# Altium project final_clock.PrjPCB
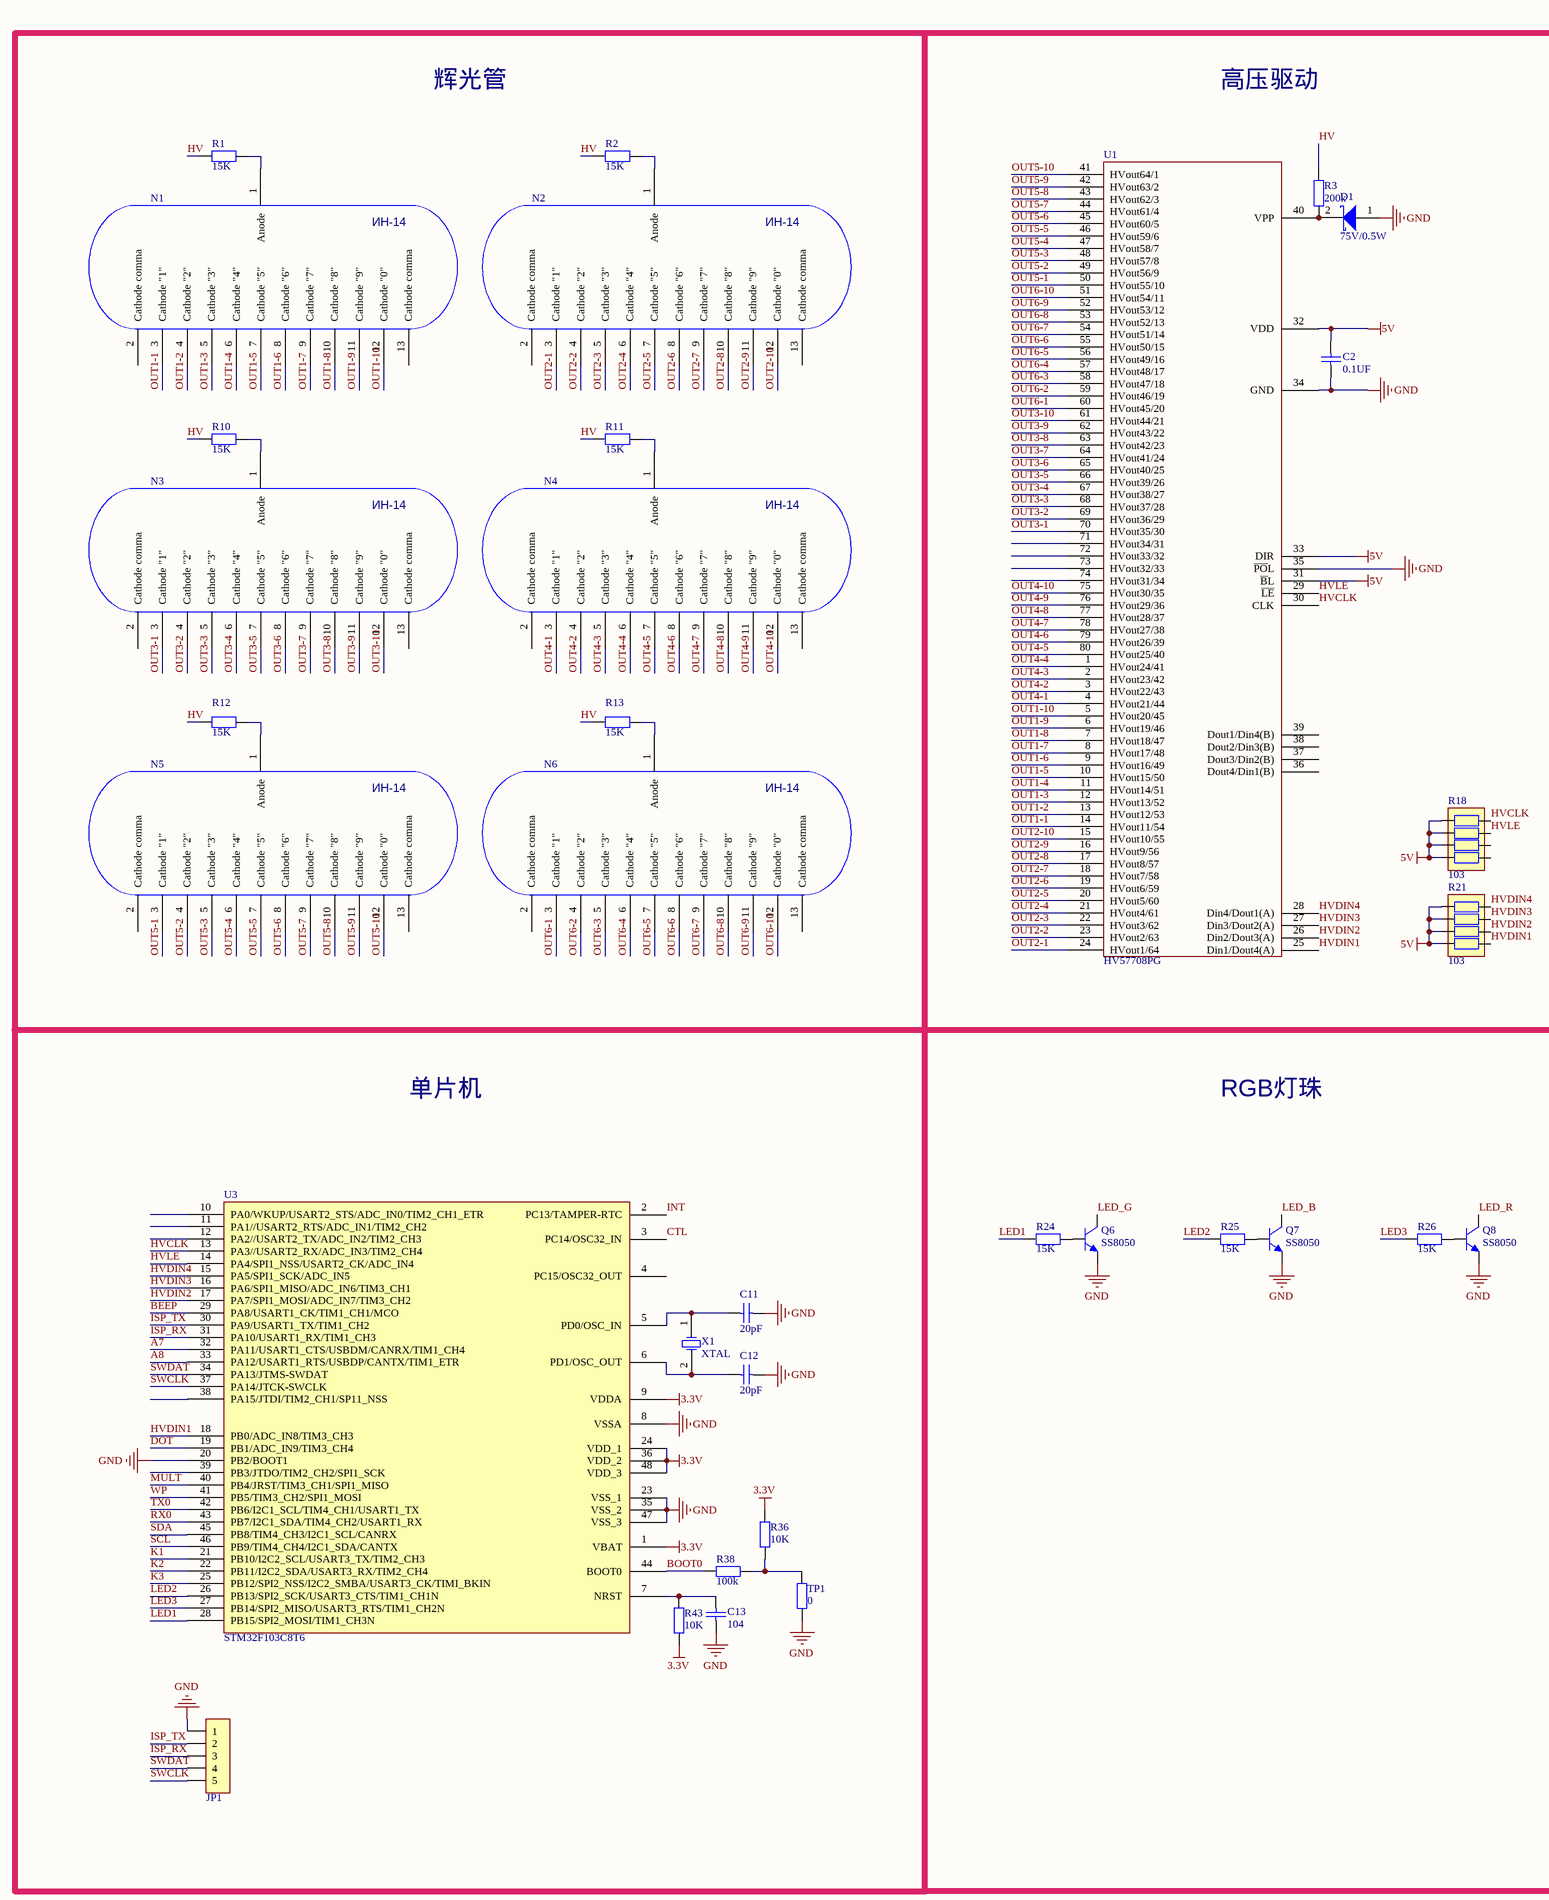
[diagram p0: final_clock.SchDoc, left]
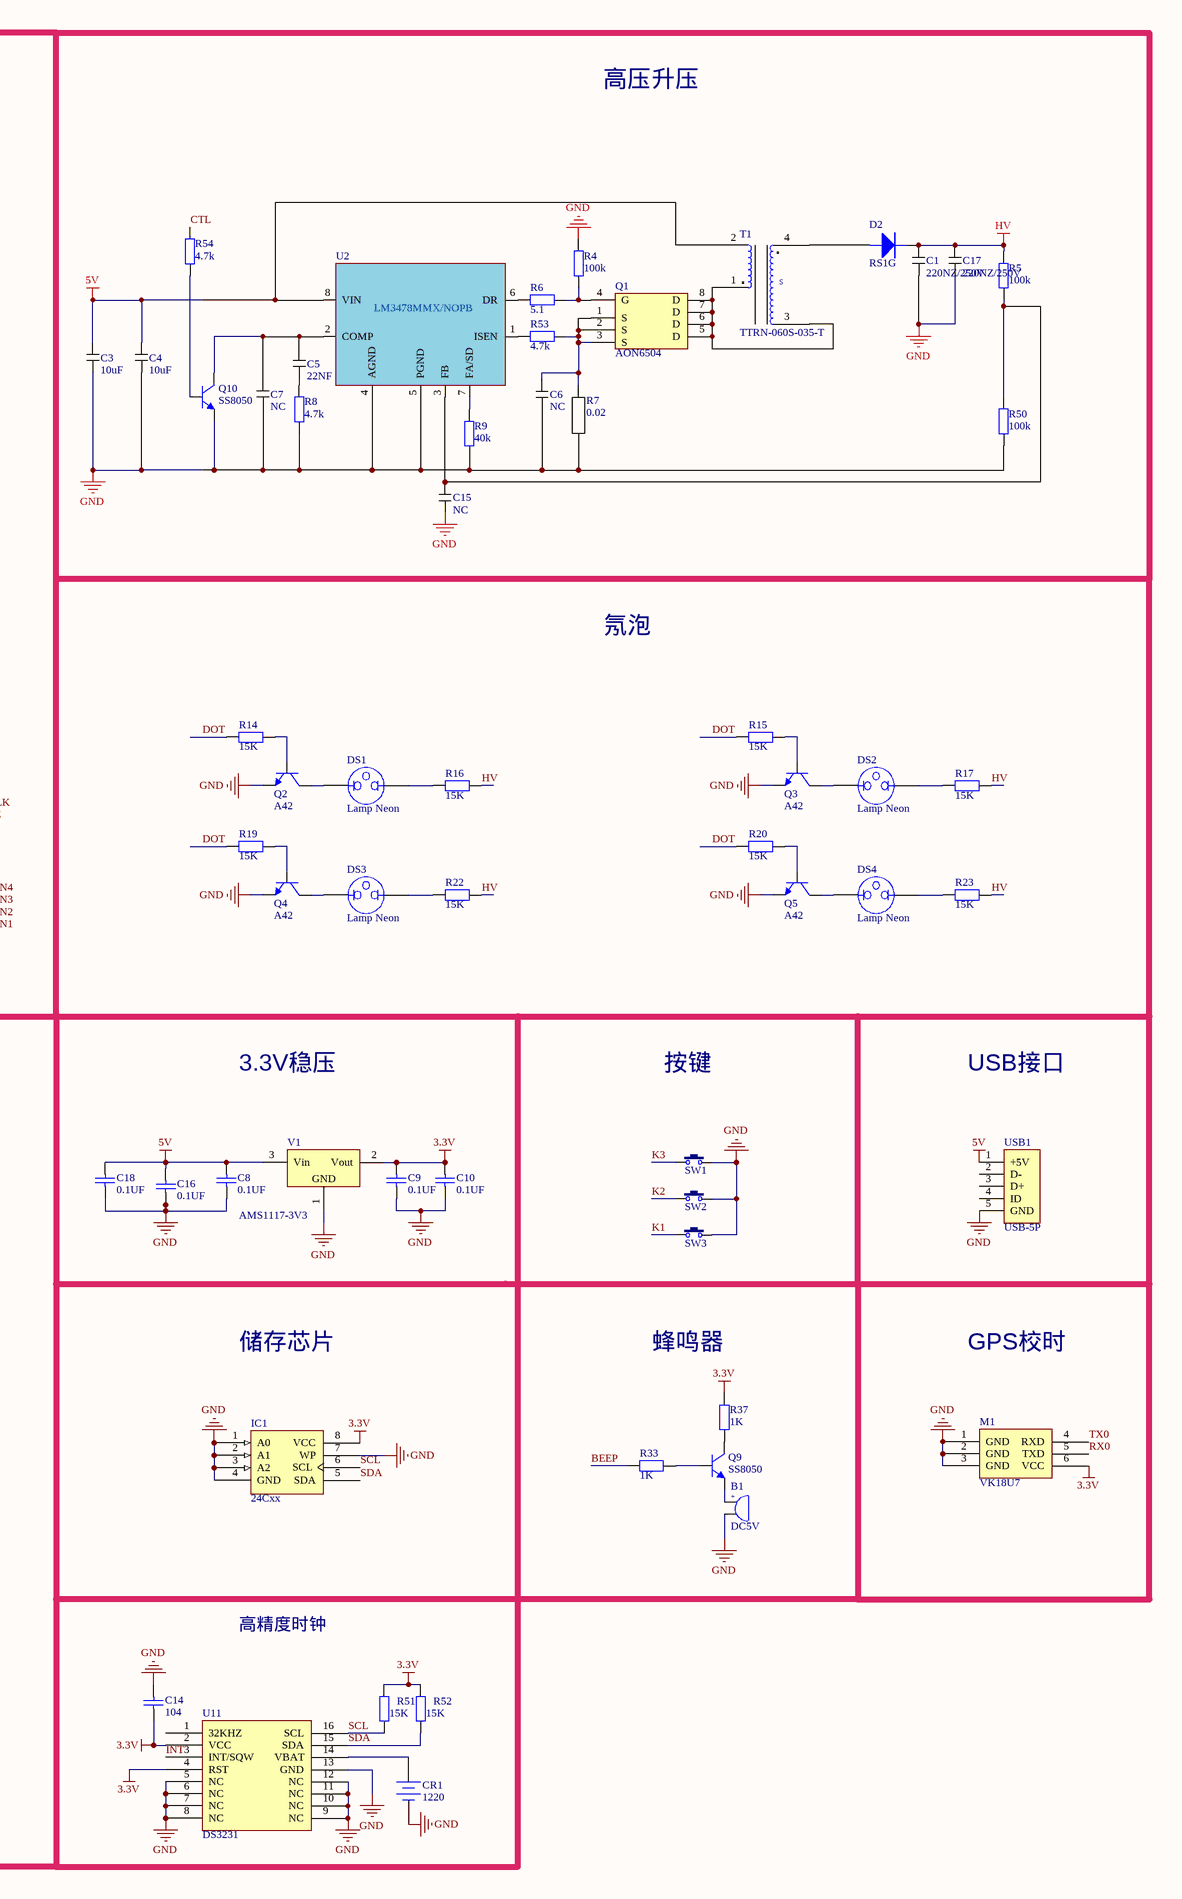
[diagram p1: final_clock.SchDoc, right]
1 sheet, 93 parts. Net scope: global (net labels, ports and power ports of the same name join across sheets).
Board file: final_clock.PcbDoc

## Sheet final_clock.SchDoc
size A2

### Parts
B1  DC5V  [贴片蜂鸣器]
C1  220NZ/250V  [C 1812]
C2  value 0.1UF  [C 0805]  (hidden comment: Cap)
C3  10uF  [C 1812]
C4  10uF  [C 1812]
C5  22NF  [C 0805]
C6  NC  [C 0805]
C7  NC  [C 0805]
C8  value 0.1UF  [C 0805]  (hidden comment: Cap)
C9  value 0.1UF  [C 0805]  (hidden comment: Cap)
C10  value 0.1UF  [C 0805]  (hidden comment: Cap)
C11  value 20pF  [C 0805]  (hidden comment: Cap)
C12  value 20pF  [C 0805]  (hidden comment: Cap)
C13  value 104  [C 0805]  (hidden comment: Cap)
C14  value 104  [C 0805]  (hidden comment: Cap)
C15  NC  [C 0805]
C16  value 0.1UF  [C 0805]  (hidden comment: Cap)
C17  220NZ/250V  [C 1812]
C18  value 0.1UF  [C 0805]  (hidden comment: Cap)
CR1  1220  [CR1220_A]
D1  75V/0.5W  [R 1206]
D2  RS1G  [SMA]
DS1  Lamp Neon  [LED_PIN2]
DS2  Lamp Neon  [LED_PIN2]
DS3  Lamp Neon  [LED_PIN2]
DS4  Lamp Neon  [LED_PIN2]
IC1  24Cxx  [SOP8_L]
JP1  HDR-1X5  [HDR-1X5]  (value not drawn)
M1  VK18U7  [VK18U7]
N1  ИН-14  [IN14]  (value not drawn)
N2  ИН-14  [IN14]  (value not drawn)
N3  ИН-14  [IN14]  (value not drawn)
N4  ИН-14  [IN14]  (value not drawn)
N5  ИН-14  [IN14]  (value not drawn)
N6  ИН-14  [IN14]  (value not drawn)
Q1  AON6504  [DFN-MOS]
Q2  A42  [SOT23-3L]
Q3  A42  [SOT23-3L]
Q4  A42  [SOT23-3L]
Q5  A42  [SOT23-3L]
Q6  SS8050  [SOT23-3L]
Q7  SS8050  [SOT23-3L]
Q8  SS8050  [SOT23-3L]
Q9  SS8050  [SOT23-3L]
Q10  SS8050  [SOT23-3L]
R1  value 15K  [R 0805]  (hidden comment: Res2)
R2  value 15K  [R 0805]  (hidden comment: Res2)
R3  value 200k  [R 0805]  (hidden comment: Res2)
R4  value 100k  [R 0805]  (hidden comment: Res2)
R5  value 100k  [R 0805]  (hidden comment: Res2)
R6  value 5.1  [R 0805]  (hidden comment: Res2)
R7  0.02  [R 1206]
R8  value 4.7k  [R 0805]  (hidden comment: Res2)
R9  value 40k  [R 0805]  (hidden comment: Res2)
R10  value 15K  [R 0805]  (hidden comment: Res2)
R11  value 15K  [R 0805]  (hidden comment: Res2)
R12  value 15K  [R 0805]  (hidden comment: Res2)
R13  value 15K  [R 0805]  (hidden comment: Res2)
R14  value 15K  [R 0805]  (hidden comment: Res2)
R15  value 15K  [R 0805]  (hidden comment: Res2)
R16  value 15K  [R 0805]  (hidden comment: Res2)
R17  value 15K  [R 0805]  (hidden comment: Res2)
R18  103  [RCA-8P4R-0603]
R19  value 15K  [R 0805]  (hidden comment: Res2)
R20  value 15K  [R 0805]  (hidden comment: Res2)
R21  103  [RCA-8P4R-0603]
R22  value 15K  [R 0805]  (hidden comment: Res2)
R23  value 15K  [R 0805]  (hidden comment: Res2)
R24  value 15K  [R 0805]  (hidden comment: Res2)
R25  value 15K  [R 0805]  (hidden comment: Res2)
R26  value 15K  [R 0805]  (hidden comment: Res2)
R33  value 1K  [R 0805]  (hidden comment: Res2)
R36  value 10K  [R 0805]  (hidden comment: Res2)
R37  value 1K  [R 0805]  (hidden comment: Res2)
R38  value 100k  [R 0805]  (hidden comment: Res2)
R43  value 10K  [R 0805]  (hidden comment: Res2)
R50  value 100k  [R 0805]  (hidden comment: Res2)
R51  value 15K  [R 0805]  (hidden comment: Res2)
R52  value 15K  [R 0805]  (hidden comment: Res2)
R53  value 4.7k  [R 0805]  (hidden comment: Res2)
R54  value 4.7k  [R 0805]  (hidden comment: Res2)
SW1  3x6x5  [贴片侧式按键]  (value not drawn)
SW2  3x6x5  [贴片侧式按键]  (value not drawn)
SW3  3x6x5  [贴片侧式按键]  (value not drawn)
T1  TTRN-060S-035-T  [EE5.0]
TP1  value 0  [R 0805]  (hidden comment: Res2)
U1  HV57708PG  [CQFP80]
U2  PackageReference: LM3478MMX/NOPB  [SSOP8_N]  (hidden comment: LM3478MM)
U3  STM32F103C8T6  [LQFP48 7X7_N]
U11  DS3231  [SOP16W_M]
USB1  USB-5P  [USB-MICRO_A]
V1  AMS1117-3V3  [_SOT-223]
X1  XTAL  [5032-xtal]

### Blocks framed on the sheet
辉光管: N1-N6 R1 R2 R10-R13

### Nets
3.3V: C9.2 C10.2 C14.1 IC1.8(VCC) M1.6(VCC) R36.2 R37.2 R43.2 R51.1 R52.1 U3.1(VBAT) U3.9(VDDA) U3.24(VDD_1) U3.36(VDD_2) U3.48(VDD_3) U11.2(VCC) U11.4(RST) V1.2(Vout)
5V: C2.2 C3.2 C4.2 C8.2 C16.2 C18.2 R18.1 R18.2 R18.3 R18.4 R21.1 R21.2 R21.3 R21.4 T1.2 U1.31(~{B}L) U1.32(VDD) U1.33(DIR) U2.8(VIN) USB1.1(+5V) V1.3(Vin)
GND: B1.2 C1.1 C2.1 C3.1 C4.1 C6.2 C7.1 C8.1 C9.1 C10.1 C11.2 C12.1 C13.1 C14.2 C15.2 C16.1 C17.1 C18.1 CR1.2(DC-) D1.1(A) IC1.1(A0) IC1.2(A1) IC1.3(A2) IC1.4(GND) IC1.7(WP) JP1.1 M1.1(GND) M1.2(GND) M1.3(GND) Q2.2(E) Q3.2(E) Q4.2(E) Q5.2(E) Q6.2(E) Q7.2(E) Q8.2(E) Q10.2(E) R4.1 R7.1 R8.2 R9.2 R50.2 SW1.2 SW2.2 SW3.2 TP1.1 U1.34(GND) U1.35(~{PO}L) U2.4(AGND) U2.5(PGND) U3.8(VSSA) U3.20(PB2/BOOT1) U3.23(VSS_1) U3.35(VSS_2) U3.47(VSS_3) U11.5(NC) U11.6(NC) U11.7(NC) U11.8(NC) U11.9(NC) U11.10(NC) U11.11(NC) U11.12(NC) U11.13(GND) USB1.5(GND) V1.1(GND)
HV: C1.2 C17.2 D2.2(K) R1.2 R2.2 R3.1 R5.1 R10.2 R11.2 R12.2 R13.2 R16.1 R17.1 R22.1 R23.1
A7: U3.32(PA11/USART1_CTS/USBDM/CANRX/TIM1_CH4)
A8: U3.33(PA12/USART1_RTS/USBDP/CANTX/TIM1_ETR)
BEEP: R33.1 U3.29(PA8/USART1_CK/TIM1_CH1/MCO)
BOOT0: R38.1 U3.44(BOOT0)
CTL: R54.2 U3.3(PC14/OSC32_IN)
DOT: R14.2 R15.2 R19.2 R20.2 U3.19(PB1/ADC_IN9/TIM3_CH4)
HVCLK: R18.8 U1.30(CLK) U3.13(PA3//USART2_RX/ADC_IN3/TIM2_CH4)
HVDIN1: R21.5 U1.25(Din1/Dout4(A)) U3.18(PB0/ADC_IN8/TIM3_CH3)
HVDIN2: R21.6 U1.26(Din2/Dout3(A)) U3.17(PA7/SPI1_MOSI/ADC_IN7/TIM3_CH2)
HVDIN3: R21.7 U1.27(Din3/Dout2(A)) U3.16(PA6/SPI1_MISO/ADC_IN6/TIM3_CH1)
HVDIN4: R21.8 U1.28(Din4/Dout1(A)) U3.15(PA5/SPI1_SCK/ADC_IN5)
HVLE: R18.7 U1.29(~{LE}) U3.14(PA4/SPI1_NSS/USART2_CK/ADC_IN4)
INT: U3.2(PC13/TAMPER-RTC) U11.3(INT/SQW)
ISP_RX: JP1.3 U3.31(PA10/USART1_RX/TIM1_CH3)
ISP_TX: JP1.2 U3.30(PA9/USART1_TX/TIM1_CH2)
K1: SW3.1 U3.21(PB10/I2C2_SCL/USART3_TX/TIM2_CH3)
K2: SW2.1 U3.22(PB11/I2C2_SDA/USART3_RX/TIM2_CH4)
K3: SW1.1 U3.25(PB12/SPI2_NSS/I2C2_SMBA/USART3_CK/TIMI_BKIN)
LED1: R24.2 U3.28(PB15/SPI2_MOSI/TIM1_CH3N)
LED2: R25.2 U3.26(PB13/SPI2_SCK/USART3_CTS/TIM1_CH1N)
LED3: R26.2 U3.27(PB14/SPI2_MISO/USART3_RTS/TIM1_CH2N)
LED_B: Q7.3(C)
LED_G: Q6.3(C)
LED_R: Q8.3(C)
MULT: U3.40(PB4/JRST/TIM3_CH1/SPI1_MISO)
OUT1-1: N1.3(Cathode_"1") U1.14(HVout11/54)
OUT1-2: N1.4(Cathode_"2") U1.13(HVout12/53)
OUT1-3: N1.5(Cathode_"3") U1.12(HVout13/52)
OUT1-4: N1.6(Cathode_"4") U1.11(HVout14/51)
OUT1-5: N1.7(Cathode_"5") U1.10(HVout15/50)
OUT1-6: N1.8(Cathode_"6") U1.9(HVout16/49)
OUT1-7: N1.9(Cathode_"7") U1.8(HVout17/48)
OUT1-8: N1.10(Cathode_"8") U1.7(HVout18/47)
OUT1-9: N1.11(Cathode_"9") U1.6(HVout19/46)
OUT1-10: N1.12(Cathode_"0") U1.5(HVout20/45)
OUT2-1: N2.3(Cathode_"1") U1.24(HVout1/64)
OUT2-2: N2.4(Cathode_"2") U1.23(HVout2/63)
OUT2-3: N2.5(Cathode_"3") U1.22(HVout3/62)
OUT2-4: N2.6(Cathode_"4") U1.21(HVout4/61)
OUT2-5: N2.7(Cathode_"5") U1.20(HVout5/60)
OUT2-6: N2.8(Cathode_"6") U1.19(HVout6/59)
OUT2-7: N2.9(Cathode_"7") U1.18(HVout7/58)
OUT2-8: N2.10(Cathode_"8") U1.17(HVout8/57)
OUT2-9: N2.11(Cathode_"9") U1.16(HVout9/56)
OUT2-10: N2.12(Cathode_"0") U1.15(HVout10/55)
OUT3-1: N3.3(Cathode_"1") U1.70(HVout35/30)
OUT3-2: N3.4(Cathode_"2") U1.69(HVout36/29)
OUT3-3: N3.5(Cathode_"3") U1.68(HVout37/28)
OUT3-4: N3.6(Cathode_"4") U1.67(HVout38/27)
OUT3-5: N3.7(Cathode_"5") U1.66(HVout39/26)
OUT3-6: N3.8(Cathode_"6") U1.65(HVout40/25)
OUT3-7: N3.9(Cathode_"7") U1.64(HVout41/24)
OUT3-8: N3.10(Cathode_"8") U1.63(HVout42/23)
OUT3-9: N3.11(Cathode_"9") U1.62(HVout43/22)
OUT3-10: N3.12(Cathode_"0") U1.61(HVout44/21)
OUT4-1: N4.3(Cathode_"1") U1.4(HVout21/44)
OUT4-2: N4.4(Cathode_"2") U1.3(HVout22/43)
OUT4-3: N4.5(Cathode_"3") U1.2(HVout23/42)
OUT4-4: N4.6(Cathode_"4") U1.1(HVout24/41)
OUT4-5: N4.7(Cathode_"5") U1.80(HVout25/40)
OUT4-6: N4.8(Cathode_"6") U1.79(HVout26/39)
OUT4-7: N4.9(Cathode_"7") U1.78(HVout27/38)
OUT4-8: N4.10(Cathode_"8") U1.77(HVout28/37)
OUT4-9: N4.11(Cathode_"9") U1.76(HVout29/36)
OUT4-10: N4.12(Cathode_"0") U1.75(HVout30/35)
OUT5-1: N5.3(Cathode_"1") U1.50(HVout55/10)
OUT5-2: N5.4(Cathode_"2") U1.49(HVout56/9)
OUT5-3: N5.5(Cathode_"3") U1.48(HVout57/8)
OUT5-4: N5.6(Cathode_"4") U1.47(HVout58/7)
OUT5-5: N5.7(Cathode_"5") U1.46(HVout59/6)
OUT5-6: N5.8(Cathode_"6") U1.45(HVout60/5)
OUT5-7: N5.9(Cathode_"7") U1.44(HVout61/4)
OUT5-8: N5.10(Cathode_"8") U1.43(HVout62/3)
OUT5-9: N5.11(Cathode_"9") U1.42(HVout63/2)
OUT5-10: N5.12(Cathode_"0") U1.41(HVout64/1)
OUT6-1: N6.3(Cathode_"1") U1.60(HVout45/20)
OUT6-2: N6.4(Cathode_"2") U1.59(HVout46/19)
OUT6-3: N6.5(Cathode_"3") U1.58(HVout47/18)
OUT6-4: N6.6(Cathode_"4") U1.57(HVout48/17)
OUT6-5: N6.7(Cathode_"5") U1.56(HVout49/16)
OUT6-6: N6.8(Cathode_"6") U1.55(HVout50/15)
OUT6-7: N6.9(Cathode_"7") U1.54(HVout51/14)
OUT6-8: N6.10(Cathode_"8") U1.53(HVout52/13)
OUT6-9: N6.11(Cathode_"9") U1.52(HVout53/12)
OUT6-10: N6.12(Cathode_"0") U1.51(HVout54/11)
RX0: M1.5(TXD) U3.43(PB7/I2C1_SDA/TIM4_CH2/USART1_RX)
SCL: IC1.6(SCL) R51.2 U3.46(PB9/TIM4_CH4/I2C1_SDA/CANTX) U11.16(SCL)
SDA: IC1.5(SDA) R52.2 U3.45(PB8/TIM4_CH3/I2C1_SCL/CANRX) U11.15(SDA)
SWCLK: JP1.5 U3.37(PA14/JTCK-SWCLK)
SWDAT: JP1.4 U3.34(PA13/JTMS-SWDAT)
TX0: M1.4(RXD) U3.42(PB6/I2C1_SCL/TIM4_CH1/USART1_TX)
WP: U3.41(PB5/TIM3_CH2/SPI1_MOSI)
NetB1_1: B1.1 Q9.2(E)
NetC5_1: C5.1 R8.1
NetC5_2: C5.2 C7.2 Q10.3(C) U2.2(COMP)
NetC6_1: C6.1 Q1.1(S) Q1.2(S) Q1.3(S) R7.2 R53.2
NetC11_1: C11.1 U3.5(PD0/OSC_IN) X1.1(OSC1)
NetC12_2: C12.2 U3.6(PD1/OSC_OUT) X1.2(OSC2)
NetC13_2: C13.2 R43.1 U3.7(NRST)
NetC15_1: C15.1 R5.2 R50.1 U2.3(FB)
NetCR1_1: CR1.1(DC+) U11.14(VBAT)
NetD1_2: D1.2(K) R3.2 U1.40(VPP)
NetD2_1: D2.1(A) T1.4
NetDS1_1: DS1.1 Q2.3(C)
NetDS1_2: DS1.2 R16.2
NetDS2_1: DS2.1 Q3.3(C)
NetDS2_2: DS2.2 R17.2
NetDS3_1: DS3.1 Q4.3(C)
NetDS3_2: DS3.2 R22.2
NetDS4_1: DS4.1 Q5.3(C)
NetDS4_2: DS4.2 R23.2
NetN1_1: N1.1(Anode) R1.1
NetN2_1: N2.1(Anode) R2.1
NetN3_1: N3.1(Anode) R10.1
NetN4_1: N4.1(Anode) R11.1
NetN5_1: N5.1(Anode) R12.1
NetN6_1: N6.1(Anode) R13.1
NetQ1_4: Q1.4(G) R4.2 R6.2
NetQ1_5: Q1.5(D) Q1.6(D) Q1.7(D) Q1.8(D) T1.1 T1.3
NetQ2_1: Q2.1(B) R14.1
NetQ3_1: Q3.1(B) R15.1
NetQ4_1: Q4.1(B) R19.1
NetQ5_1: Q5.1(B) R20.1
NetQ6_1: Q6.1(B) R24.1
NetQ7_1: Q7.1(B) R25.1
NetQ8_1: Q8.1(B) R26.1
NetQ9_1: Q9.1(B) R33.2
NetQ9_3: Q9.3(C) R37.1
NetQ10_1: Q10.1(B) R54.1
NetR6_1: R6.1 U2.6(DR)
NetR9_1: R9.1 U2.7(FA/SD)
NetR36_1: R36.1 R38.2 TP1.2
NetR53_1: R53.1 U2.1(ISEN)

Not connected (* = marked no-connect by the designer): N1 2(Cathode_comma) 13(Cathode_comma); N2 2(Cathode_comma) 13(Cathode_comma); N3 2(Cathode_comma) 13(Cathode_comma); N4 2(Cathode_comma) 13(Cathode_comma); N5 2(Cathode_comma) 13(Cathode_comma); N6 2(Cathode_comma) 13(Cathode_comma); R18 5 6; U1 36(Dout4/Din1(B)) 37(Dout3/Din2(B)) 38(Dout2/Din3(B)) 39(Dout1/Din4(B)) 71(HVout34/31) 72(HVout33/32) 73(HVout32/33) 74(HVout31/34); U3 4(PC15/OSC32_OUT) 10(PA0/WKUP/USART2_STS/ADC_IN0/TIM2_CH1_ETR) 11(PA1//USART2_RTS/ADC_IN1/TIM2_CH2) 12(PA2//USART2_TX/ADC_IN2/TIM2_CH3) 38(PA15/JTDI/TIM2_CH1/SP11_NSS) 39(PB3/JTDO/TIM2_CH2/SPI1_SCK); U11 1(32KHZ); USB1 2(D-) 3(D+) 4(ID)

### Notes on the sheet
- 高压驱动
- 高压升压
- 氖泡
- 3.3V稳压
- 按键
- USB接口
- 单片机
- RGB灯珠
- 储存芯片
- 蜂鸣器
- GPS校时
- 高精度时钟
- (in symbol BEEP) +
- (in symbol TTRN-060S-035-T) .; S

### Library data of the parts
B1 = BEEP: 蜂鸣器; 版权归属: 源创客; BOM名称: 蜂鸣器; 学习资源: www.ooocke.com
C1 C3-C7 C15 C17 = CAP: 无极性电容
C2 C8-C14 C16 C18 = Cap: Capacitor; Published: 8-Jun-2000; LatestRevisionDate: 17-Jul-2002; LatestRevisionNote: Re-released for DXP Platform.; PackageReference: RAD-0.3; Publisher: Altium Limited; PackageDescription: Radial Cap, Thru-Hole; 2 Leads; 0.3 in Pin Spacing
CR1 = CR-3V: 微型电池; 版权归属: 源创客; BOM名称: 微型电池; 学习资源: www.ooocke.com
D1 = Diode 10TQ040: Schottky Rectifier; Note: Terminal 2 is the TAB and is electrically connected to the cathode; Published: 8-Jun-2000; LatestRevisionDate: 17-Jul-2002; LatestRevisionNote: Re-released for DXP Platform.; DatasheetVersion: PD-2.057B; PackageVersion: Feb-1998; PackageReference: TO-220AC; Publisher: Altium Limited; PackageDescription: TO, Thru-Hole, Vertical, Heatsink Mounted; 3 In-Line Leads (1 Absent); Pitch 2.54 mm; ComponentLink1Description: Manufacturer Link; ComponentLink1URL: http://www.irf.com/
D2 = RS1G: 贴片快恢复二极管; 参数: 1A/400V
DS1-DS4 = Lamp Neon: Neon Lamp; Published: 24-Mar-1999; LatestRevisionDate: 17-Jul-2002; LatestRevisionNote: Re-released for DXP Platform.; PackageReference: PIN2; Publisher: Altium Limited
IC1 = 24Cxx: 外置EEPROM; 版权归属: 源创客; BOM名称: 外置EEPROM; 学习资源: www.ooocke.com
JP1 = Header 5: 5P接插件; 版权归属: 源创客; BOM名称: 5P接插件; 学习资源: www.ooocke.com
Q1 = AON6: N沟道MOS管; 参数: 30V,85A
Q2-Q10 = 8050-SMD: 高频放大-NPN型; 版权归属: 源创客; 属性: 40V 1.5A 1W 100MHZ; BOM名称: 高频放大-NPN型; 学习资源: www.ooocke.com
R1-R6 R8-R17 R19 R20 R22-R26 R33 R36-R38 R43 R50-R54 TP1 = Res2: Resistor; Published: 8-Jun-2000; LatestRevisionDate: 17-Jul-2002; LatestRevisionNote: Re-released for DXP Platform.; PackageReference: AXIAL-0.4; Publisher: Altium Limited; PackageDescription: Axial Device, Thru-Hole; 2 Leads; 0.4 in Pin Spacing
R7 = RES
R18 R21 = R-8P4R: 贴片网络排阻; 版权归属: 源创客; BOM名称: 贴片网络排阻; 学习资源: www.ooocke.com
SW1-SW3 = TSW 3x6: 3x6轻触开关; 版权归属: 源创客; BOM名称: 3x6轻触开关; 学习资源: www.ooocke.com
T1 = TTRN-060S-035-T: 闪光灯变压器
U2 = LM3478MM: 开关电源芯片; Manufacturer Part Number: LM3478MM/NOPB; Manufacturer Name: Texas Instruments; Value: N/A
USB1 = USB-5P: 微型USB母座; 版权归属: 源创客; BOM名称: 微型USB母座; 学习资源: www.ooocke.com
V1 = AMS1117: 三端稳压芯片; BOM名称: 稳压芯片; 版权归属: 源创客; 学习资源: www.ooocke.com
X1 = XTAL: Crystal Oscillator; Published: 8-Jun-2000; LatestRevisionDate: 17-Jul-2002; LatestRevisionNote: Re-released for DXP Platform.; PackageReference: R38; Publisher: Altium Limited